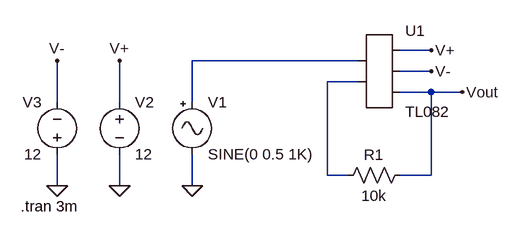
[diagram p0: schematic TL082.asc]
TL082.asc, the LTspice schematic file:
Version 4
SHEET 1 880 680
WIRE 448 -16 400 -16
WIRE 336 0 80 0
WIRE 448 16 400 16
WIRE 336 32 288 32
WIRE 448 48 400 48
WIRE 496 48 448 48
WIRE -128 64 -128 0
WIRE -32 64 -32 0
WIRE 80 64 80 0
WIRE 288 176 288 32
WIRE 320 176 288 176
WIRE 448 176 448 48
WIRE 448 176 400 176
WIRE -128 192 -128 144
WIRE -32 192 -32 144
WIRE 80 192 80 144
FLAG 80 192 0
FLAG 448 -16 V+
FLAG 448 16 V-
FLAG -32 192 0
FLAG -128 192 0
FLAG -128 0 V-
FLAG -32 0 V+
FLAG 496 48 Vout
SYMBOL Misc\\signal 80 48 R0
WINDOW 123 0 0 Left 0
WINDOW 39 0 0 Left 0
SYMATTR InstName V1
SYMATTR Value SINE(0 0.5 1K)
SYMBOL res 416 160 R90
WINDOW 0 0 56 VBottom 2
WINDOW 3 32 56 VTop 2
SYMATTR InstName R1
SYMATTR Value 10k
SYMBOL voltage -32 48 R0
WINDOW 123 0 0 Left 0
WINDOW 39 0 0 Left 0
SYMATTR InstName V2
SYMATTR Value 12
SYMBOL voltage -128 160 R180
WINDOW 0 24 96 Left 2
WINDOW 3 24 16 Left 2
WINDOW 123 0 0 Left 0
WINDOW 39 0 0 Left 0
SYMATTR InstName V3
SYMATTR Value 12
SYMBOL AutoGenerated\\TL082 368 16 R0
SYMATTR InstName U1
TEXT -184 224 Left 2 !.tran 3m

The netlist it stands for:
* TL082.asc
V1 N001 0 SINE(0 0.5 1K)
R1 Vout N002 10k
V2 V+ 0 12
V3 0 V- 12
* U1: TL082 (symbol AutoGenerated\TL082 not available, pins judged from their places): pin1=N001 pin2=N002 pin3=V+ pin4=V- pin5=Vout
.tran 3m
.backanno
.end